# Altium project PCB_Project.PrjPcb
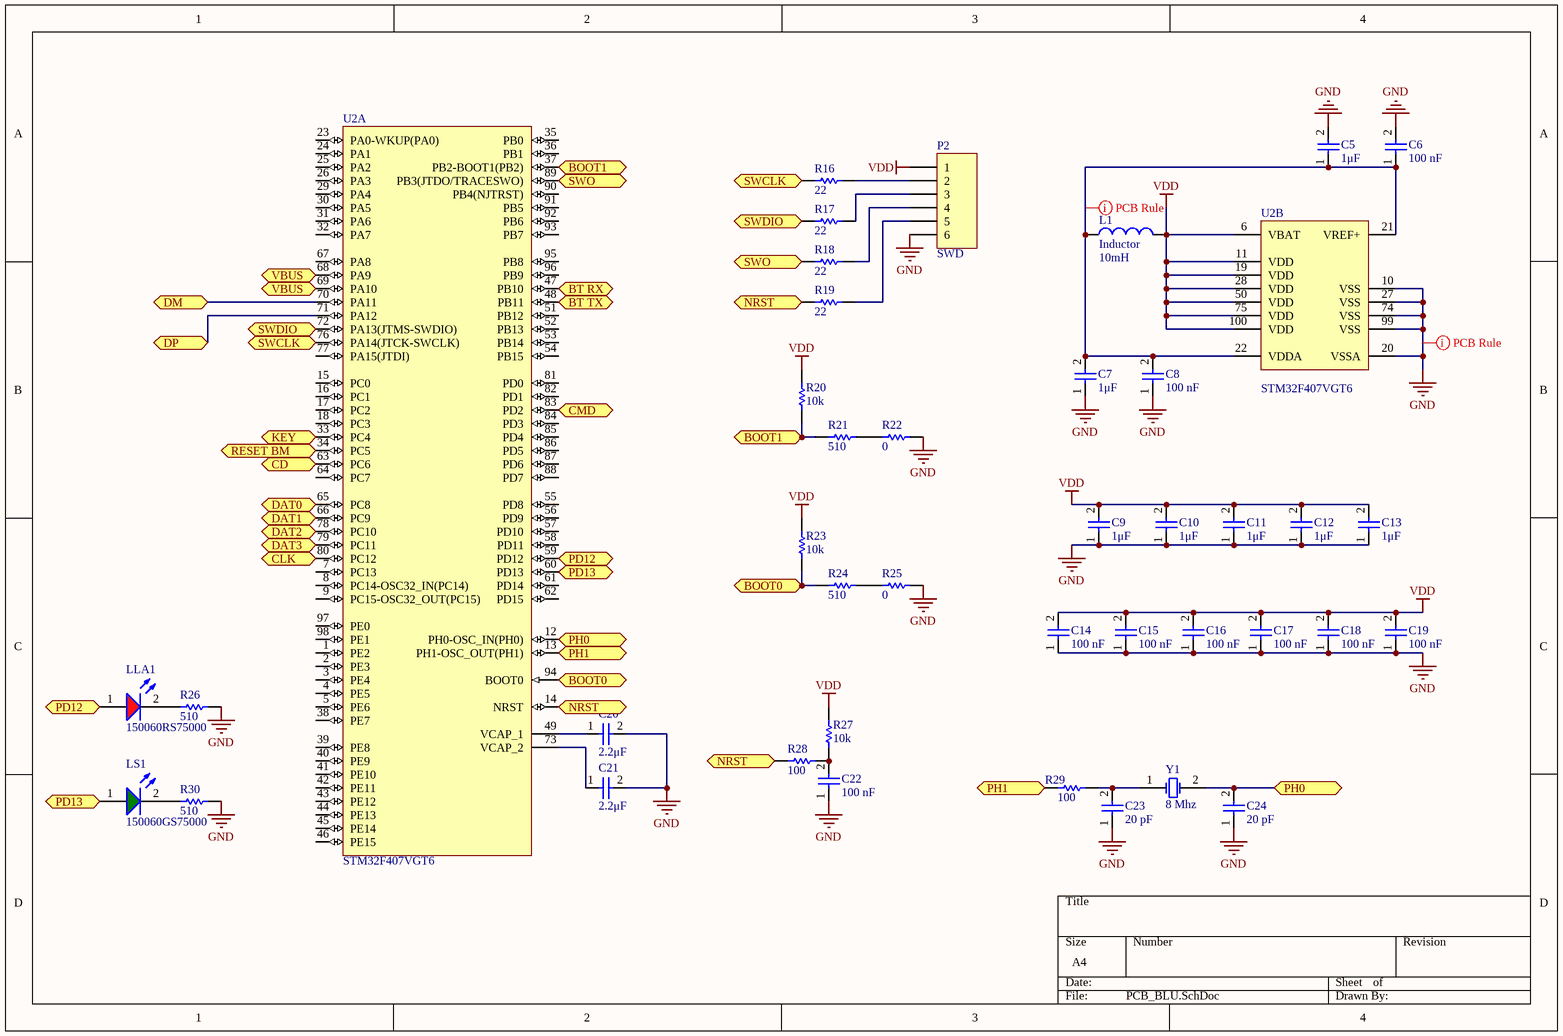
[diagram p0: PCB_BLU.SchDoc]
4 sheets, 67 parts. Net scope: flat (ports and power ports of the same name join across sheets).
Board file: PCB_BLU_2.PcbDoc
Sheets:
  PCB_BLU.SchDoc
  PCB_BLU1.SchDoc
  PCB_BLU2.SchDoc
  PCB_BLU3.SchDoc

## Sheet PCB_BLU.SchDoc
size A4

### Parts
C5  1μF  [WCAP-CSGP 1210, H=1.25mm]
C6  100 nF  [WCAP-CSGP 1206, H=0.8mm]
C7  1μF  [WCAP-CSGP 1210, H=1.25mm]
C8  100 nF  [WCAP-CSGP 1206, H=0.8mm]
C9  1μF  [WCAP-CSGP 1210, H=1.25mm]
C10  1μF  [WCAP-CSGP 1210, H=1.25mm]
C11  1μF  [WCAP-CSGP 1210, H=1.25mm]
C12  1μF  [WCAP-CSGP 1210, H=1.25mm]
C13  1μF  [WCAP-CSGP 1210, H=1.25mm]
C14  100 nF  [WCAP-CSGP 1206, H=0.8mm]
C15  100 nF  [WCAP-CSGP 1206, H=0.8mm]
C16  100 nF  [WCAP-CSGP 1206, H=0.8mm]
C17  100 nF  [WCAP-CSGP 1206, H=0.8mm]
C18  100 nF  [WCAP-CSGP 1206, H=0.8mm]
C19  100 nF  [WCAP-CSGP 1206, H=0.8mm]
C20  2.2μF  [WCAP-CSGP 0805, H=1.25mm]
C21  2.2μF  [WCAP-CSGP 0805, H=1.25mm]
C22  100 nF  [WCAP-CSGP 1206, H=0.8mm]
C23  20 pF  [WCAP-CSGP 0603, H=0.8mm]
C24  20 pF  [WCAP-CSGP 0603, H=0.8mm]
L1  Inductor  value 10mH  [0603]
LLA1  150060RS75000  [LED_0603_Red]
LS1  150060GS75000  [LED_0603_Green]
P2  SWD  [HDR1X6]
R16  22  [RES0402R]
R17  22  [RES0402R]
R18  22  [RES0402R]
R19  22  [RES0402R]
R20  10k  [RES0201R]
R21  510  [RES0201R]
R22  0  [RES0201R]
R23  10k  [RES0201R]
R24  510  [RES0201R]
R25  0  [RES0201R]
R26  510  [RES0402R]
R27  10k  [RES0201R]
R28  100  [RES0201R]
R29  100  [RES0402R]
R30  510  [RES0402R]
U2  STM32F407VGT6  [STM-LQFP100_N]  (parts A,B of 2)
Y1  8 Mhz  [3SMXA]

### Ports
BOOT0 (bidir), BOOT1 (bidir), BT RX (bidir), BT TX (in), CD (bidir), CLK (bidir), CMD (bidir), DAT0 (bidir), DAT1 (bidir), DAT2 (bidir), DAT3 (bidir), DM (bidir), DP (bidir), KEY (bidir), NRST (bidir), PD12 (bidir), PD13 (bidir), PH0 (bidir), PH1 (bidir), RESET BM (bidir), SWCLK (bidir), SWDIO (bidir), SWO (bidir), VBUS (bidir)

### Nets
GND: C5.2 C6.2 C7.1 C8.1 C9.1 C10.1 C11.1 C12.1 C13.1 C14.1 C15.1 C16.1 C17.1 C18.1 C19.1 C20.2 C21.2 C22.1 C23.1 C24.1 P2.6 R22.1 R25.1 R26.1 R30.1 U2.10(VSS) U2.20(VSSA) U2.27(VSS) U2.74(VSS) U2.99(VSS)
VDD: C9.2 C10.2 C11.2 C12.2 C13.2 C14.2 C15.2 C16.2 C17.2 C18.2 C19.2 L1.2 P2.1 R20.2 R23.2 R27.1 U2.6(VBAT) U2.11(VDD) U2.19(VDD) U2.28(VDD) U2.50(VDD) U2.75(VDD) U2.100(VDD)
NetC5_1: C5.1 C6.1 C7.2 C8.2 L1.1 U2.21(VREF+) U2.22(VDDA)
NetC20_1: C20.1 U2.49(VCAP_1)
NetC21_1: C21.1 U2.73(VCAP_2)
NetC22_2: C22.2 R27.2 R28.1
NetC23_2: C23.2 R29.1 Y1.1(OSC1)
NetC24_2: C24.2 U2.12(PH0-OSC_IN(PH0)) Y1.2(OSC2) ; port PH0
NetD1_1: U2.70(PA11) ; port DM
NetD1_4: U2.71(PA12) ; port DP
NetD1_5: U2.68(PA9) U2.69(PA10) ; port VBUS
NetJ1_1: U2.78(PC10) ; port DAT2
NetJ1_2: U2.79(PC11) ; port DAT3
NetJ1_3: U2.83(PD2) ; port CMD
NetJ1_5: U2.80(PC12) ; port CLK
NetJ1_7: U2.65(PC8) ; port DAT0
NetJ1_8: U2.66(PC9) ; port DAT1
NetJ1_10: U2.63(PC6) ; port CD
NetLLA1_1: LLA1.1(A) U2.59(PD12) ; port PD12
NetLLA1_2: LLA1.2(C) R26.2
NetLS1_1: LS1.1(A) U2.60(PD13) ; port PD13
NetLS1_2: LS1.2(C) R30.2
NetM1_11: U2.34(PC5) ; port RESET BM
NetM1_34: U2.33(PC4) ; port KEY
NetP2_2: P2.2 R16.1
NetP2_3: P2.3 R17.1
NetP2_4: P2.4 R18.1
NetP2_5: P2.5 R19.1
NetR8_2: U2.47(PB10) ; port BT RX
NetR9_1: U2.48(PB11) ; port BT TX
NetR16_2: R16.2 U2.76(PA14(JTCK-SWCLK)) ; port SWCLK
NetR17_2: R17.2 U2.72(PA13(JTMS-SWDIO)) ; port SWDIO
NetR18_2: R18.2 U2.89(PB3(JTDO/TRACESWO)) ; port SWO
NetR19_2: R19.2 R28.2 U2.14(NRST) ; port NRST
NetR20_1: R20.1 R21.2 U2.37(PB2-BOOT1(PB2)) ; port BOOT1
NetR21_1: R21.1 R22.2
NetR23_1: R23.1 R24.2 U2.94(BOOT0) ; port BOOT0
NetR24_1: R24.1 R25.2
NetR29_2: R29.2 U2.13(PH1-OSC_OUT(PH1)) ; port PH1

Not connected (* = marked no-connect by the designer): U2 1(PE2) 2(PE3) 3(PE4) 4(PE5) 5(PE6) 7(PC13) 8(PC14-OSC32_IN(PC14)) 9(PC15-OSC32_OUT(PC15)) 15(PC0) 16(PC1) 17(PC2) 18(PC3) 23(PA0-WKUP(PA0)) 24(PA1) 25(PA2) 26(PA3) 29(PA4) 30(PA5) 31(PA6) 32(PA7) 35(PB0) 36(PB1) 38(PE7) 39(PE8) 40(PE9) 41(PE10) 42(PE11) 43(PE12) 44(PE13) 45(PE14) 46(PE15) 51(PB12) 52(PB13) 53(PB14) 54(PB15) 55(PD8) 56(PD9) 57(PD10) 58(PD11) 61(PD14) 62(PD15) 64(PC7) 67(PA8) 77(PA15(JTDI)) 81(PD0) 82(PD1) 84(PD3) 85(PD4) 86(PD5) 87(PD6) 88(PD7) 90(PB4(NJTRST)) 91(PB5) 92(PB6) 93(PB7) 95(PB8) 96(PB9) 97(PE0) 98(PE1)

### Layout directives
rule Width Constraint [Pref Width = 0.7mm    Min Width = 0.254mm    Max Width = 0.7mm]: GND, NetC5_1

### Library data of the parts
C5 C7 C9-C13 = WCAP-CSGP 1210, 885012209011: WCAP-CSGP MLCC, X7R, 1210, 1μF pF,16Vdc; Manufacturer: Wurth Elektronik; E-mail: libraries@we-online.com; ComponentLink1Description: Manufacturer; ComponentLink1URL: http://www.we-online.com; ComponentLink2Description: Datasheet; ComponentLink2URL: http://katalog.we-online.de/pbs/datasheet/885012209011.pdf; Created by: Karrer Zheng; Created Date: 3/9/2015; Capacitance: 1μF; partNo: 885012209011
C6 C8 C14-C19 C22 = WCAP-CSGP 1206, 885012208009: WCAP-CSGP MLCC, X7R, 1206, 100000 pF,10Vdc; Manufacturer: Wurth Elektronik; E-mail: libraries@we-online.com; ComponentLink1Description: Manufacturer; ComponentLink1URL: http://www.we-online.com; ComponentLink2Description: Datasheet; ComponentLink2URL: http://katalog.we-online.de/pbs/datasheet/885012208009.pdf; Created by: Karrer Zheng; Created Date: 3/9/2015; Capacitance: 100 nF; partNo: 885012208009
C20 C21 = WCAP-CSGP 0805, 885012207024: WCAP-CSGP MLCC, X7R, 0805, 2.2μF ,10Vdc; Manufacturer: Wurth Elektronik; E-mail: libraries@we-online.com; ComponentLink1Description: Manufacturer; ComponentLink1URL: http://www.we-online.com; ComponentLink2Description: Datasheet; ComponentLink2URL: http://katalog.we-online.de/pbs/datasheet/885012207024.pdf; Created by: Karrer Zheng; Created Date: 3/9/2015; Capacitance: 2.2μF; partNo: 885012207024
C23 C24 = WCAP-CSGP 0603, 885012006004: WCAP-CSGP MLCC, NP0, 0603, 22 pF,10Vdc; Manufacturer: Wurth Elektronik; E-mail: libraries@we-online.com; ComponentLink1Description: Manufacturer; ComponentLink1URL: http://www.we-online.com; ComponentLink2Description: Datasheet; ComponentLink2URL: http://katalog.we-online.de/pbs/datasheet/885012006004.pdf; Created by: Karrer Zheng; Created Date: 3/9/2015; Capacitance: 20 pF; partNo: 885012006004
L1 = Inductor: Code_IEC: 1005; Published: 8-Jun-2000; LatestRevisionDate: 29-May-2009; LatestRevisionNote: IPC-7351 Footprint Added.; PackageReference: 0402-A; Publisher: Altium Limited; PackageDescription: Chip Inductor; Code_JEITA: 0402
LLA1 = WL-SMCW 0603  150060RS75000: SMD mono-color Chip LED, WL-SMCW, Red; Manufacturer: W黵th Elektronik eiSos GmbH; PartNo: 150060RS75000; ComponentLink1Description: Manufacturer; ComponentLink1URL: http://www.we-online.de; Created by: Christin Otto; Created Date: June 2013; ComponentLink2Description: Datasheet; ComponentLink2URL: http://katalog.we-online.com/led/datasheet/150060RS75000.pdf; Color: Red
LS1 = WL-SMCW 0603  150060GS75000: SMD mono-color Chip LED, WL-SMCW, Green; Manufacturer: W黵th Elektronik eiSos GmbH; PartNo: 150060GS75000; ComponentLink1Description: Manufacturer; ComponentLink1URL: http://www.we-online.de; Created by: Christin Otto; Created Date: June 2013; ComponentLink2Description: Datasheet; ComponentLink2URL: http://katalog.we-online.com/led/datasheet/150060GS75000.pdf; Color: Green
P2 = Header 6: Header, 6-Pin; LatestRevisionDate: 17-Jul-2002; LatestRevisionNote: Re-released for DXP Platform.; Publisher: Altium Limited
R16-R30 = Resistor1: Resistor; Value: =Value
U2 = STM32F407VGT6: ARM Cortex-M4 32-bit MCU+FPU, 210 DMIPS, 1024 kB Flash, 192 kB Internal RAM, 82 I/Os, 100-pin LQFP, -40 to 85 degC, Tray; Manufacturer: STMicroelectronics; D/A Converter: 2x12-bit; FLASH Size (Prog) (kB): 1024; I/Os (High Current): 82; Internal RAM Size (kB): 192; Operating Frequency(F) (Processor speed) (MHz): 168; Supply Voltage(Vcc) max (V): 3.6; Supply Voltage(Vcc) min (V): 1.8; DatasheetVersion: Rev. 4; PackageVersion: Rev. 1, 06/2013; PackageReference: LQFP100; PackageDescription: 100-Pin Low Profile Quad Flat Package, 14 x 14 mm Body, 0.5 mm Pitch; Supplier 1: Digi-Key; Supplier Part Number 1: 497-11605-ND; Supplier 2: Farnell; Supplier Part Number 2: 2064368; Supplier 3: Newark; Supplier Part Number 3: 73T2333; Supplier 4: Mouser; Supplier Part Number 4: 511-STM32F407VGT6; Core: ARM Cortex-M4; Packing: Tray; Mounting Technology: Surface Mount; PartNumber: STM32F407VGT6; ComponentLink1Description: Manufacturer URL; ComponentLink1URL: http://www.st.com/web/en/home.html; ComponentLink2Description: Datasheet; ComponentLink2URL: http://www.st.com/st-web-ui/static/active/en/resource/technical/document/datasheet/DM00037051.pdf; ComponentLink3Description: Package Specification; ComponentLink3URL: http://www.st.com/st-web-ui/static/active/en/resource/technical/document/data_brief/DM00071938.pdf
Y1 = XTAL: Crystal Oscillator; Published: 8-Jun-2000; LatestRevisionDate: 17-Jul-2002; LatestRevisionNote: Re-released for DXP Platform.; PackageReference: R38; Publisher: Altium Limited; PackageDescription: Crystal, Thru-Hole; 2 Leads; Body 3.1 x 8.2 mm (Dia.xH)

## Sheet PCB_BLU1.SchDoc
size A4
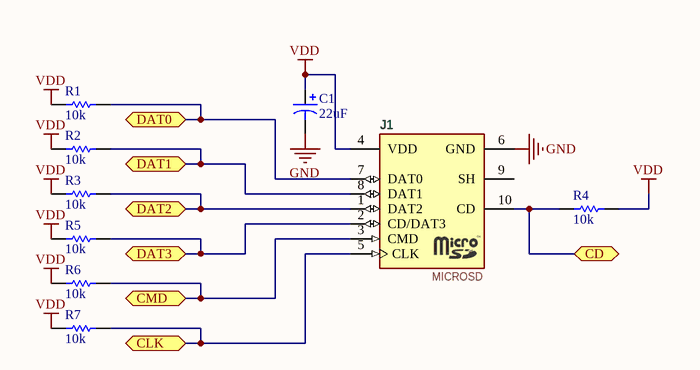
[diagram p1: PCB_BLU1.SchDoc]

### Parts
C1  22uF  [6032]
J1  MICROSD  [MICROSD]
R1  10k  [RES0201R]
R2  10k  [RES0201R]
R3  10k  [RES0201R]
R4  10k  [RES0201R]
R5  10k  [RES0201R]
R6  10k  [RES0201R]
R7  10k  [RES0201R]

### Ports
CD (bidir), CLK (bidir), CMD (bidir), DAT0 (bidir), DAT1 (bidir), DAT2 (bidir), DAT3 (bidir)

### Nets
GND: C1.2 J1.6(GND)
VDD: C1.1 J1.4(VDD) R1.2 R2.2 R3.2 R4.1 R5.2 R6.2 R7.2
NetJ1_1: J1.1(DAT2) R3.1 ; port DAT2
NetJ1_2: J1.2(CD/DAT3) R5.1 ; port DAT3
NetJ1_3: J1.3(CMD) R6.1 ; port CMD
NetJ1_5: J1.5(CLK) R7.1 ; port CLK
NetJ1_7: J1.7(DAT0) R1.1 ; port DAT0
NetJ1_8: J1.8(DAT1) R2.1 ; port DAT1
NetJ1_10: J1.10(CD) R4.2 ; port CD

Not connected (* = marked no-connect by the designer): J1 9(SH)

### Library data of the parts
C1 = CWR11DH226M: Tantamount Military, Surface Mount MIL-PRF-55365/8 Qualified Solid Tantalum Chip Capacitor: 22uF, 20% Tolerance, 6 WVDC @ +85°C, Surge = 8V; Note: See Data Sheet for full range of components; Published: 19-Mar-2004; DatasheetDocument: 20-Mar-2003; PackageReference: 6032; Publisher: Altium Limited; Code_JEITA: 6032; ComponentLink1Description: Manufacturer Link; ComponentLink1URL: http://www.vishay.com/; ComponentLink2Description: Datasheet; ComponentLink2URL: http://www.vishay.com/docs/40011/cwr11.pdf; Value: 22uF
J1 = MICROSD: Memory Card Connectors Molex 504528-0892
R1-R7 = Resistor1: Resistor; Value: =Value

## Sheet PCB_BLU2.SchDoc
size A4
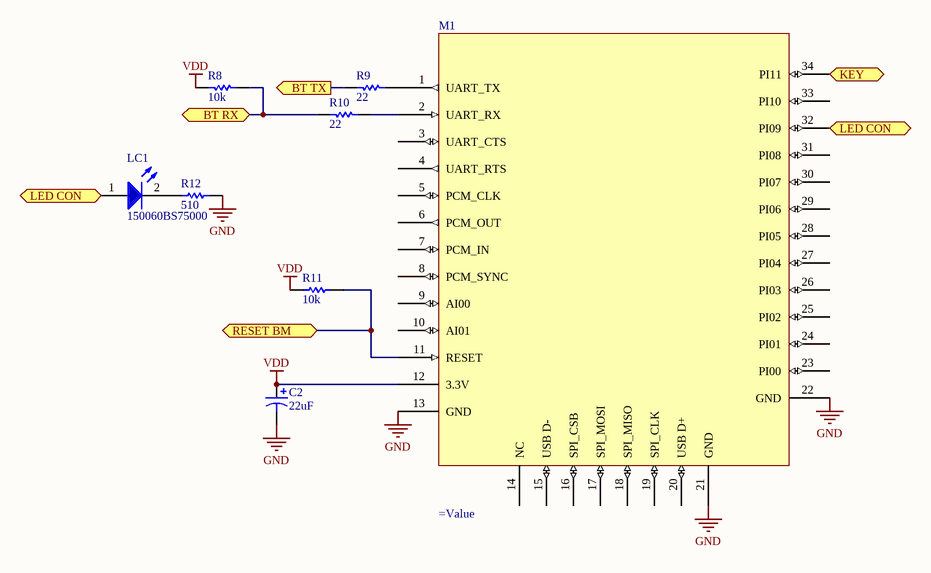
[diagram p2: PCB_BLU2.SchDoc]

### Parts
C2  22uF  [6032]
LC1  150060BS75000  [LED_0603_Blue]
M1  (no value)  [HC-05-LAND]
R8  10k  [RES0201R]
R9  22  [RES0201R]
R10  22  [RES0201R]
R11  10k  [RES0402R]
R12  510  [RES0402R]

### Ports
BT RX (bidir), BT TX (out), KEY (bidir), LED CON (bidir), RESET BM (bidir)

### Nets
GND: C2.2 M1.13(GND) M1.21(GND) M1.22(GND) R12.2
VDD: C2.1 M1.12(3.3V) R8.1 R11.1
NetLC1_1: LC1.1(A) M1.32(PI09) ; port LED CON
NetLC1_2: LC1.2(C) R12.1
NetM1_1: M1.1(UART_TX) R9.2
NetM1_2: M1.2(UART_RX) R10.2
NetM1_11: M1.11(RESET) R11.2 ; port RESET BM
NetM1_34: M1.34(PI11) ; port KEY
NetR8_2: R8.2 R10.1 ; port BT RX
NetR9_1: R9.1 ; port BT TX

Not connected (* = marked no-connect by the designer): M1 3(UART_CTS) 4(UART_RTS) 5(PCM_CLK) 6(PCM_OUT) 7(PCM_IN) 8(PCM_SYNC) 9(AI00) 10(AI01) 14(NC) 15(USB_D-) 16(SPI_CSB) 17(SPI_MOSI) 18(SPI_MISO) 19(SPI_CLK) 20(USB_D+) 23(PI00) 24(PI01) 25(PI02) 26(PI03) 27(PI04) 28(PI05) 29(PI06) 30(PI07) 31(PI08) 33(PI10)

### Library data of the parts
C2 = CWR11DH226M: as C1 on sheet PCB_BLU1; Published: 19-Mar-2004; DatasheetDocument: 20-Mar-2003; PackageReference: 6032; Publisher: Altium Limited; Code_JEITA: 6032; ComponentLink1Description: Manufacturer Link; ComponentLink1URL: http://www.vishay.com/; ComponentLink2Description: Datasheet; ComponentLink2URL: http://www.vishay.com/docs/40011/cwr11.pdf; Value: 22uF
LC1 = WL-SMCW 0603  150060BS75000: SMD mono-color Chip LED, WL-SMCW, Blue; Manufacturer: W黵th Elektronik eiSos GmbH; PartNo: 150060BS75000; ComponentLink1Description: Manufacturer; ComponentLink1URL: http://www.we-online.de; Created by: Christin Otto; Created Date: June 2013; ComponentLink2Description: Datasheet; ComponentLink2URL: http://katalog.we-online.com/led/datasheet/150060BS75000.pdf; Color: Blue
M1 = HC-05MOD: HC-05 Module; Value: =Value; Type: HC-05 Bluetooth module
R8-R12 = Resistor1: Resistor; Value: =Value

## Sheet PCB_BLU3.SchDoc
size A4
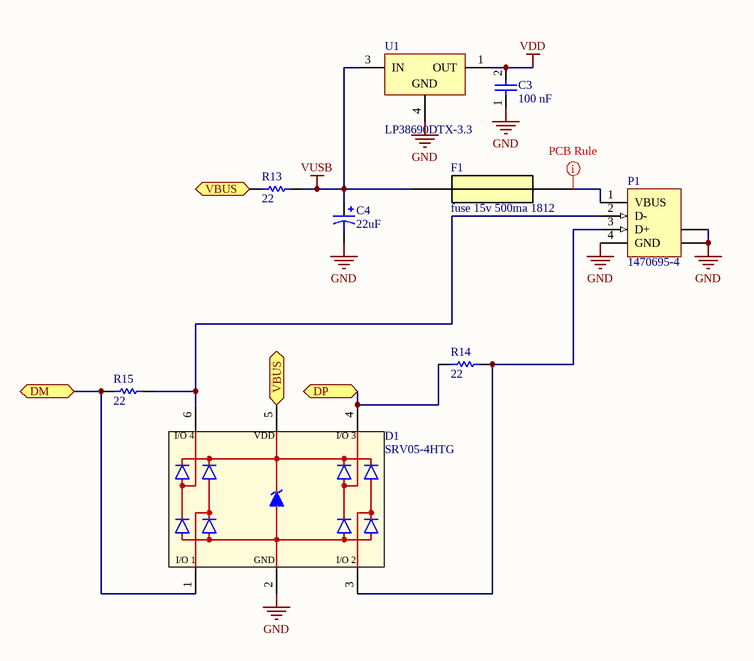
[diagram p3: PCB_BLU3.SchDoc]

### Parts
C3  100 nF  [WCAP-CSGP 1206, H=0.8mm]
C4  22uF  [6032]
D1  SRV05-4HTG  [SOT23-6L]
F1  fuse 15v 500ma 1812  [Fuse-LAND]
P1  1470695-4  [1470695A]
R13  22  [RES0402R]
R14  22  [RES0402R]
R15  22  [RES0402R]
U1  LP38690DTX-3.3  [TD03B_N]

### Ports
DM (bidir), DP (bidir), VBUS (bidir)

### Nets
GND: C3.1 C4.2 D1.2(GND) P1.4(GND) P1.5(SHLD) P1.6(SHLD) U1.4(GND)
VDD: C3.2 U1.1(OUT)
VUSB: C4.1 F1.1 R13.1 U1.3(IN)
NetD1_1: D1.1(I/O_1) R15.2 ; port DM
NetD1_3: D1.3(I/O_2) P1.3(D+) R14.1
NetD1_4: D1.4(I/O_3) R14.2 ; port DP
NetD1_5: D1.5(VDD) R13.2 ; port VBUS
NetD1_6: D1.6(I/O_4) P1.2(D-) R15.1
NetF1_2: F1.2 P1.1(VBUS)

### Layout directives
rule Width Constraint [Pref Width = 0.7mm    Min Width = 0.254mm    Max Width = 0.7mm]: NetF1_2

### Library data of the parts
C3 = WCAP-CSGP 1206, 885012208009: as C6 on sheet PCB_BLU; ComponentLink1Description: Manufacturer; ComponentLink1URL: http://www.we-online.com; ComponentLink2Description: Datasheet; ComponentLink2URL: http://katalog.we-online.de/pbs/datasheet/885012208009.pdf; Created by: Karrer Zheng; Created Date: 3/9/2015; Capacitance: 100 nF; partNo: 885012208009
C4 = CWR11DH226M: as C1 on sheet PCB_BLU1; Published: 19-Mar-2004; DatasheetDocument: 20-Mar-2003; PackageReference: 6032; Publisher: Altium Limited; Code_JEITA: 6032; ComponentLink1Description: Manufacturer Link; ComponentLink1URL: http://www.vishay.com/; ComponentLink2Description: Datasheet; ComponentLink2URL: http://www.vishay.com/docs/40011/cwr11.pdf; Value: 22uF
D1 = WE-TVS, SOT23-6L, 824001: WE-TVS TVS Diode, High Speed Series, SOT23-6L, VDC = 5V; PartNo: 824001; Manufacturer: Wurth Elektronik; VDC: 5V; ComponentLink1Description: Manufacturer; ComponentLink1URL: http://www.we-online.de; Created by: BJ.Chen; Created Date: Jan 2016; ComponentLink2Description: Datasheet; ComponentLink2URL: http://katalog.we-online.de/pbs/datasheet/824001.pdf
F1 = Fuse 500ma: FUSE; Value: fuse 15v 500ma 1812
P1 = 1470695-4: USB 1.1, Right Angle, SMT, A Type, Plug, 4 Position, Black; ContactMaterial: Brass; ContactPlating: Gold (30) over Nickel (50); PCB_Layout: Complies with manufacturer's recommendation.; DrillSize: Corresponds to nominal value.; PanelGround: Without; Published: 15-Jul-2004; DatasheetDocument: 21-Jan-2003; PackageDocument: 21-Jan-2003; PackageReference: 1470695A; Publisher: Altium Limited; HousingMaterial: Thermoplastic; ComponentLink1Description: Manufacturer Link; ComponentLink1URL: http://www.tycoelectronics.com/; ComponentLink2Description: Packaging Specification; ComponentLink2URL: http://ecommas.tycoelectronics.com/commerce/DocumentDelivery/DDEController?Action=showdoc&DocId=Customer+Drawing%7F1470695%7FO%7Fpdf%7FEnglish%7FC_1470695_O.pdf
R13-R15 = Resistor1: Resistor; Value: =Value
U1 = LP38690DTX-3.3: 1A Low Dropout CMOS Linear Regulators Stable with Ceramic Output Capacitors, 3-pin TO-252; Manufacturer: National Semiconductor; PackageTopMarking: NSUZXYTT*LP38690*DT-3.3; PowerWise: Y; CompType: LDO IC; DatasheetVersion: May-2005; PackageVersion: revD, Feb-2009; PackageReference: TD03B; PackageDescription: TO252, Molded, Jedec, 6.8 x 6.10 x 2.30mm Body, 3 Lead, 2.28mm Pitch, Surface Mount; PartNumber: LP38690DTX-3.3; RoHS: N; PinCount: 3; High-Reliability: Y; Code_JEDEC: TO-252-AA; ComponentLink1Description: Manufacturer URL; ComponentLink1URL: http://www.national.com/; ComponentLink2Description: LP38690 Datasheet; ComponentLink2URL: http://www.national.com/ds/LP/LP38690.pdf; ComponentLink3Description: LP38690 Web Page; ComponentLink3URL: http://www.national.com/pf/LP/LP38690.html; ComponentLink4Description: TD03B Package Page; ComponentLink4URL: http://www.national.com/packaging/folders/td03b.html

## Nets that join several sheets
GND: PCB_BLU (30 pins), PCB_BLU1 (C1.2 J1.6), PCB_BLU2 (5 pins), PCB_BLU3 (7 pins)
VDD: PCB_BLU (23 pins), PCB_BLU1 (9 pins), PCB_BLU2 (C2.1 M1.12 R8.1 R11.1), PCB_BLU3 (C3.2 U1.1)
NetD1_1: PCB_BLU (U2.70), PCB_BLU3 (D1.1 R15.2)
NetD1_4: PCB_BLU (U2.71), PCB_BLU3 (D1.4 R14.2)
NetD1_5: PCB_BLU (U2.68 U2.69), PCB_BLU3 (D1.5 R13.2)
NetJ1_1: PCB_BLU (U2.78), PCB_BLU1 (J1.1 R3.1)
NetJ1_2: PCB_BLU (U2.79), PCB_BLU1 (J1.2 R5.1)
NetJ1_3: PCB_BLU (U2.83), PCB_BLU1 (J1.3 R6.1)
NetJ1_5: PCB_BLU (U2.80), PCB_BLU1 (J1.5 R7.1)
NetJ1_7: PCB_BLU (U2.65), PCB_BLU1 (J1.7 R1.1)
NetJ1_8: PCB_BLU (U2.66), PCB_BLU1 (J1.8 R2.1)
NetJ1_10: PCB_BLU (U2.63), PCB_BLU1 (J1.10 R4.2)
NetM1_11: PCB_BLU (U2.34), PCB_BLU2 (M1.11 R11.2)
NetM1_34: PCB_BLU (U2.33), PCB_BLU2 (M1.34)
NetR8_2: PCB_BLU (U2.47), PCB_BLU2 (R8.2 R10.1)
NetR9_1: PCB_BLU (U2.48), PCB_BLU2 (R9.1)